# EAGLE design Lightpack6.0L (EAGLE 6.2)
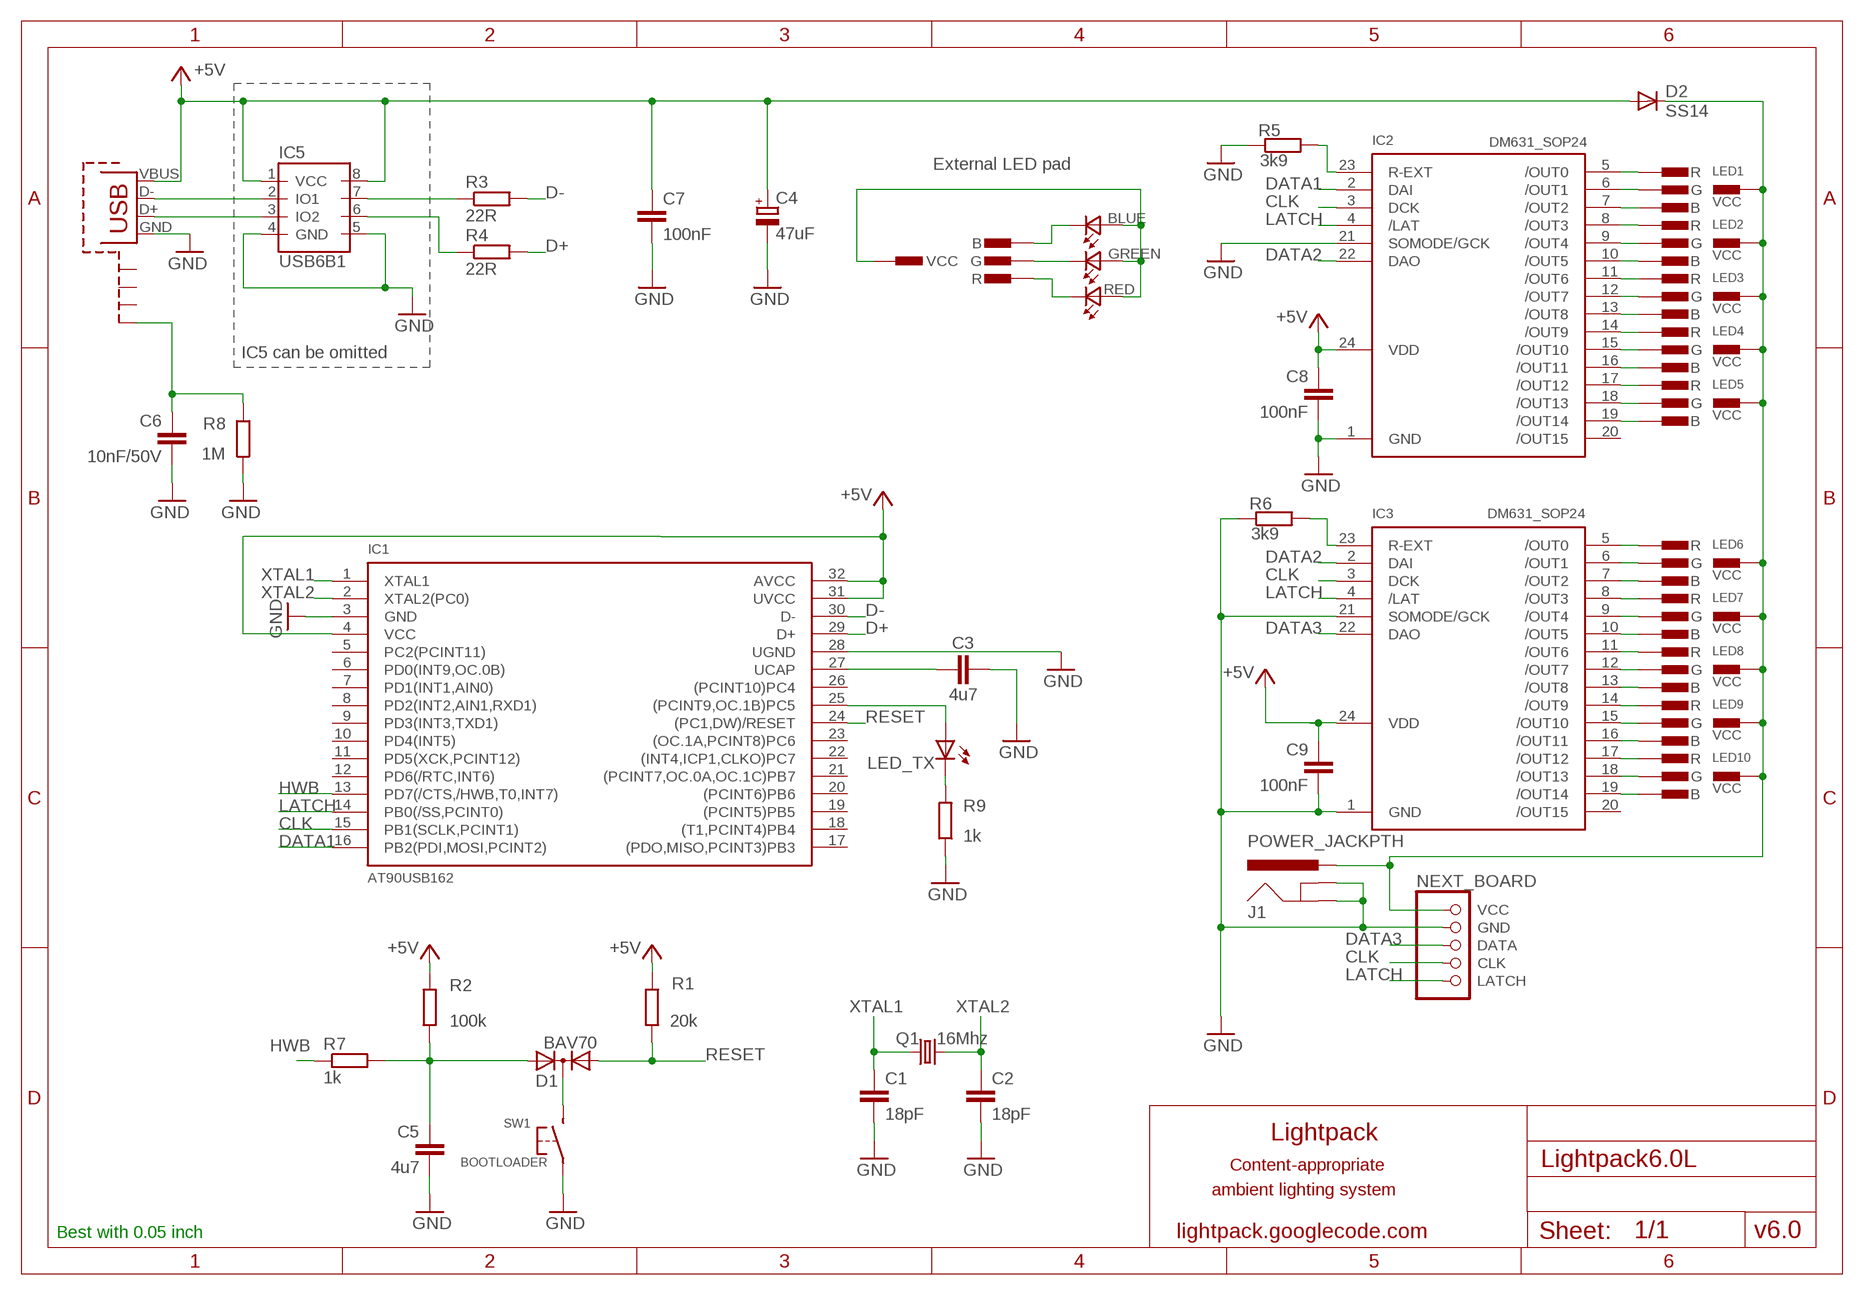
[diagram p0: schematic, sheet 1]

## Parts
C1  18pF  C-EUC1206  [C1206]
C2  18pF  C-EUC1206  [C1206]
C3  4u7  C-EUC1206  [C1206]
C4  47uF  CPOL-EUD/7343-31W  [D/7343-31W]
C5  4u7  C-EUC1206  [C1206]
C6  10nF/50V  C-EUC1206  [C1206]
C7  100nF  C-EUC1206  [C1206]
C8  100nF  C-EUC1206  [C1206]
C9  100nF  C-EUC1206  [C1206]
D1  BAV70  DIODE-2AC|CASOT23  [SOT23]
D2  SS14  DIODE-SMB  [SMB]
EXT_LED  TOPLED-3RF-W2SA50TS  [LP2C63-ST-RGB-SR0]
IC1  AT90USB162  [TQFP32]
IC2  DM631_SOP24  [SOP24-300-1.27]
IC3  DM631_SOP24  [SOP24-300-1.27]
IC5  USB6B1  [SO08]
J1  POWER_JACKPTH  [POWER_JACK_PTH]
LED1  CON-RGB-LED  [CON-RGB-LED]
LED2  CON-RGB-LED  [CON-RGB-LED]
LED3  CON-RGB-LED  [CON-RGB-LED]
LED4  CON-RGB-LEDVCC-INDENT  [CON-RGB-LED-WITH-VCC-INDENT]
LED5  CON-RGB-LEDVCC-INDENT  [CON-RGB-LED-WITH-VCC-INDENT]
LED6  CON-RGB-LED  [CON-RGB-LED]
LED7  CON-RGB-LED  [CON-RGB-LED]
LED8  CON-RGB-LED  [CON-RGB-LED]
LED9  CON-RGB-LED  [CON-RGB-LED]
LED10  CON-RGB-LED  [CON-RGB-LED]
LED12  CON-RGB-LED"  [CON-RGB-LED]
LED_TX  GREEN  LEDCHIPLED_0805  [CHIPLED_0805]
NEXT_BOARD  LED_DRIVER_BOARD  [DATA-CLK-LATCH]
Q1  16Mhz  CRYSTALHC49UP  [HC49UP]
R1  20k  R-EU_R1206  [R1206]
R2  100k  R-EU_R1206_2  [R1206]
R3  22R  R-EU_R1206  [R1206]
R4  22R  R-EU_R1206  [R1206]
R5  3k9  R-EU_R1206  [R1206]
R6  3k9  R-EU_R1206  [R1206]
R7  1k  R-EU_R1206  [R1206]
R8  1M  R-EU_R1206  [R1206]
R9  1k  R-EU_R1206  [R1206]
SW1  BOOTLOADER  BUTTON  [BUTTON-SMD]
X1  USB-MB-S  [USB-MB-S]

## Nets
+5V [VCC]: C4.+ C7.1 C8.1 C9.1 D2.A IC1.4(VCC) IC1.31(UVCC) IC1.32(AVCC) IC2.24(VDD) IC3.24(VDD) IC5.1(VCC) IC5.8(VCC) R1.2 R2.1 X1.VBUS
CLK: IC1.15(PB1(SCLK,PCINT1)) IC2.3(DCK) IC3.3(DCK) NEXT_BOARD.CLK
D+: IC1.29(D+) R4.2
D-: IC1.30(D-) R3.2
DATA1: IC1.16(PB2(PDI,MOSI,PCINT2)) IC2.2(DAI)
DATA2: IC2.22(DAO) IC3.2(DAI)
DATA3: IC3.22(DAO) NEXT_BOARD.DATA
GND: C1.2 C2.2 C3.1 C4.- C5.2 C6.2 C7.2 C8.2 C9.2 IC1.3(GND) IC1.28(UGND) IC2.1(GND) IC2.21(SOMODE/GCK) IC3.1(GND) IC3.21(SOMODE/GCK) IC5.4(GND) IC5.5(GND) J1.GND J1.GNDBREAK NEXT_BOARD.GND R5.1 R6.1 R8.1 R9.1 SW1.1 X1.GND
HWB: IC1.13(PD7(/CTS,/HWB,T0,INT7)) R7.1
LATCH: IC1.14(PB0(/SS,PCINT0)) IC2.4(/LAT) IC3.4(/LAT) NEXT_BOARD.LATCH
N$1: IC2.23(R-EXT) R5.2
N$2: IC3.8(/OUT3) LED7.R
N$3: IC2.13(/OUT8) LED3.B
N$4: EXT_LED.CGREEN LED12.G
N$5: IC2.5(/OUT0) LED1.R
N$6: IC2.6(/OUT1) LED1.G
N$7: IC2.7(/OUT2) LED1.B
N$8: IC1.25((PCINT9,OC.1B)PC5) LED_TX.A
N$9: IC2.8(/OUT3) LED2.R
N$10: IC2.9(/OUT4) LED2.G
N$11: IC2.10(/OUT5) LED2.B
N$12: IC2.11(/OUT6) LED3.R
N$13: IC2.12(/OUT7) LED3.G
N$14: EXT_LED.CBLUE LED12.B
N$15: IC2.14(/OUT9) LED4.R
N$16: EXT_LED.CRED LED12.R
N$17: EXT_LED.BLUE EXT_LED.GREEN EXT_LED.RED LED12.VCC
N$18: IC3.5(/OUT0) LED6.R
N$19: IC3.6(/OUT1) LED6.G
N$20: IC3.7(/OUT2) LED6.B
N$21: IC3.9(/OUT4) LED7.G
N$22: IC3.10(/OUT5) LED7.B
N$23: IC3.11(/OUT6) LED8.R
N$24: IC3.12(/OUT7) LED8.G
N$25: IC3.14(/OUT9) LED9.R
N$26: IC3.13(/OUT8) LED8.B
N$27: IC3.15(/OUT10) LED9.G
N$28: IC3.16(/OUT11) LED9.B
N$29: IC2.15(/OUT10) LED4.G
N$30: IC2.16(/OUT11) LED4.B
N$31: IC3.23(R-EXT) R6.2
N$32: IC5.2(IO1) X1.D-
N$33: IC5.6(IO2) R4.1
N$35: C6.1 R8.2 X1.SHIELD4
N$37: LED_TX.C R9.2
N$38: IC2.17(/OUT12) LED5.R
N$39: IC2.18(/OUT13) LED5.G
N$40: IC2.19(/OUT14) LED5.B
N$41: IC3.17(/OUT12) LED10.R
N$42: IC3.18(/OUT13) LED10.G
N$43: IC3.19(/OUT14) LED10.B
N$45: D1.3(C) SW1.2
N$47: C5.1 D1.2(A2) R2.2 R7.2
N$56: IC5.3(IO2) X1.D+
N$57 [VCC]: D2.C J1.PWR LED1.VCC LED2.VCC LED3.VCC LED4.VCC LED5.VCC LED6.VCC LED7.VCC LED8.VCC LED9.VCC LED10.VCC NEXT_BOARD.VCC
N$58: IC5.7(IO1) R3.1
N$60: C3.2 IC1.27(UCAP)
RESET: D1.1(A1) IC1.24((PC1,DW)/RESET) R1.1
XTAL1: C1.1 IC1.1(XTAL1) Q1.1
XTAL2: C2.1 IC1.2(XTAL2(PC0)) Q1.2
Unconnected: IC1.5(PC2(PCINT11)) IC1.6(PD0(INT9,OC.0B)) IC1.7(PD1(INT1,AIN0)) IC1.8(PD2(INT2,AIN1,RXD1)) IC1.9(PD3(INT3,TXD1)) IC1.10(PD4(INT5)) IC1.11(PD5(XCK,PCINT12)) IC1.12(PD6(/RTC,INT6)) IC1.17((PDO,MISO,PCINT3)PB3) IC1.18((T1,PCINT4)PB4) IC1.19((PCINT5)PB5) IC1.20((PCINT6)PB6) IC1.21((PCINT7,OC.0A,OC.1C)PB7) IC1.22((INT4,ICP1,CLKO)PC7) IC1.23((OC.1A,PCINT8)PC6) IC1.26((PCINT10)PC4) IC2.20(/OUT15) IC3.20(/OUT15) X1.SHIELD1 X1.SHIELD2 X1.SHIELD3

## Notes on the sheet
- External LED pad
- IC5 can be omitted
- Lightpack
- Content-appropriate
- ambient lighting system
- Best with 0.05 inch | lightpack.googlecode.com | v6.0

## Library data of the parts
C1-C3 C5-C9 = rcl:C-EU: CAPACITOR, European symbol
C4 = rcl:CPOL-EU: POLARIZED CAPACITOR, European symbol
D1 = diode:DIODE-2AC|CA: Dual DIODE Anode-Cathode|Cathode-Anode
D2 = diode:DIODE-: DIODE
EXT_LED = _led-rgb:TOPLED-3: OSRAM Edited: brunql Removed center pad in pcb - Hyper Multi TOPLED® (RGB) LB E673, LV E673, LT E673 - Power TOPLED® Enhanced optical Power LED (HOP2000) LS E67B, LA E67B, LO E67B, LY E67B - Hyper Multi TOPLED® Enhanced optical Power LED (HOP2000 / ATON®) LATB T66B - Hyper Multi TOPLED® Hyper-Bright LED LATB T686 Source: http://www.osram.convergy.de/
IC1 = AT90USB:AT90USB162: AT90USB162 Author: brunql.github.com
IC2 IC3 = _LedDrivers:DM631: DM631 Author: brunql.github.com
IC5 = st-microelectronics:USB6B1: DATA LINES PROTECTION Source: http://www.st.com/stonline/products/literature/ds/5605.pdf; MPN: USB6B1; OC_FARNELL: 9804358; OC_NEWARK: 26M4750
J1 = SparkFun:POWER_JACK: Power Jack This is the standard 5.5mm barrel jack for power. The PTH is the most common, proven, reliable, footprint. All others are experimental. The Slot footprint only works if the mill layer is transmitted to the PCB fab house so be warned. Spark Fun Electronics SKU : PRT-00119. Mating wall wart : TOL-00298 (and others)
LED1-LED3 LED6-LED10 = led-rgb:CON-RGB-LED
LED4 LED5 = br-led-rgb:CON-RGB-LED
LED12 = _led-rgb:CON-RGB-LED
LED_TX = led:LED: LED OSRAM: - CHIPLED LG R971, LG N971, LY N971, LG Q971, LY Q971, LO R971, LY R971 LH N974, LH R974 LS Q976, LO Q976, LY Q976 LO Q996 - Hyper CHIPLED LW Q18S LB Q993, LB Q99A, LB R99A - SideLED LS A670, LO A670, LY A670, LG A670, LP A670 LB A673, LV A673, LT A673, LW A673 LH A674 LY A675 LS A676, LA A676, LO A676, LY A676, LW A676 LS A679, LY A679, LG A679 - Hyper Micro SIDELED® LS Y876, LA Y876, LO Y876, LY Y876 LT Y87S - SmartLED LW L88C, LW L88S LB L89C, LB L89S, LG L890 LS L89K, LO L89K, LY L89K LS L896, LA L896, LO L896, LY L896 - TOPLED LS T670, LO T670, LY T670, LG T670, LP T670 LSG T670, LSP T670, LSY T670, LOP T670, LYG T670 LG T671, LOG T671, LSG T671 LB T673, LV T673, LT T673, LW T673 LH T674 LS T676, LA T676, LO T676, LY T676, LB T676, LH T676, LSB T676, LW T676 LB T67C, LV T67C, LT T67C, LS T67K, LO T67K, LY T67K, LW E67C LS E67B, LA E67B, LO E67B, LY E67B, LB E67C, LV E67C, LT E67C LW T67C LS T679, LY T679, LG T679 LS T770, LO T770, LY T770, LG T770, LP T770 LB T773, LV T773, LT T773, LW T773 LH T774 LS E675, LA E675, LY E675, LS T675 LS T776, LA T776, LO T776, LY T776, LB T776 LHGB T686 LT T68C, LB T68C - Hyper Mini TOPLED® LB M676 - Mini TOPLED Santana® LG M470 LS M47K, LO M47K, LY M47K Source: http://www.osram.convergy.de LUXEON: - LUMILED® LXK2-PW12-R00, LXK2-PW12-S00, LXK2-PW14-U00, LXK2-PW14-V00 LXK2-PM12-R00, LXK2-PM12-S00, LXK2-PM14-U00 LXK2-PE12-Q00, LXK2-PE12-R00, LXK2-PE12-S00, LXK2-PE14-T00, LXK2-PE14-U00 LXK2-PB12-K00, LXK2-PB12-L00, LXK2-PB12-M00, LXK2-PB14-N00, LXK2-PB14-P00, LXK2-PB14-Q00 LXK2-PR12-L00, LXK2-PR12-M00, LXK2-PR14-Q00, LXK2-PR14-R00 LXK2-PD12-Q00, LXK2-PD12-R00, LXK2-PD12-S00 LXK2-PH12-R00, LXK2-PH12-S00 LXK2-PL12-P00, LXK2-PL12-Q00, LXK2-PL12-R00 Source: www.luxeon.com KINGBRIGHT: KA-3528ASYC Source: www.kingbright.com
NEXT_BOARD = br-connectors:LED_DRIVER_BOARD: PIN HEADER
Q1 = crystal:CRYSTAL: CRYSTAL; OC_FARNELL: unknown; OC_NEWARK: unknown
R1 R2 R5 R6 = br-zero-res:R-EU_: RESISTOR, European symbol
R3 R4 R7-R9 = rcl:R-EU_: RESISTOR, European symbol
SW1 = button-smd:BUTTON: Button SMD
X1 = USB_miniB:USB: USB Connector miniUSB type B

## Net classes
1 VCC: width 0.6 mm, clearance 0.6 mm

## Board
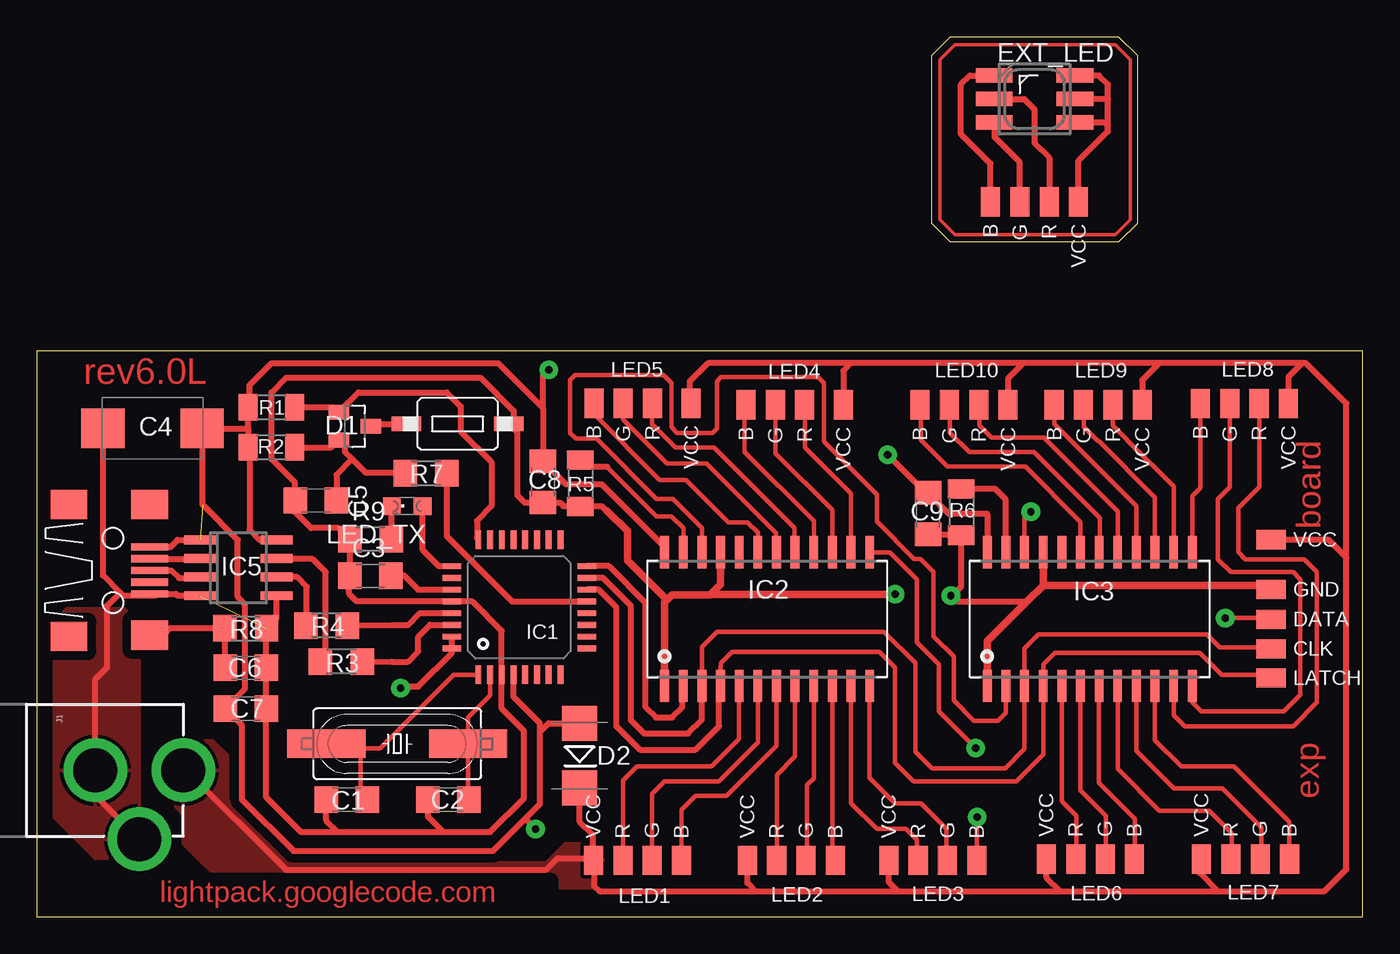
[diagram p1: board, top side]
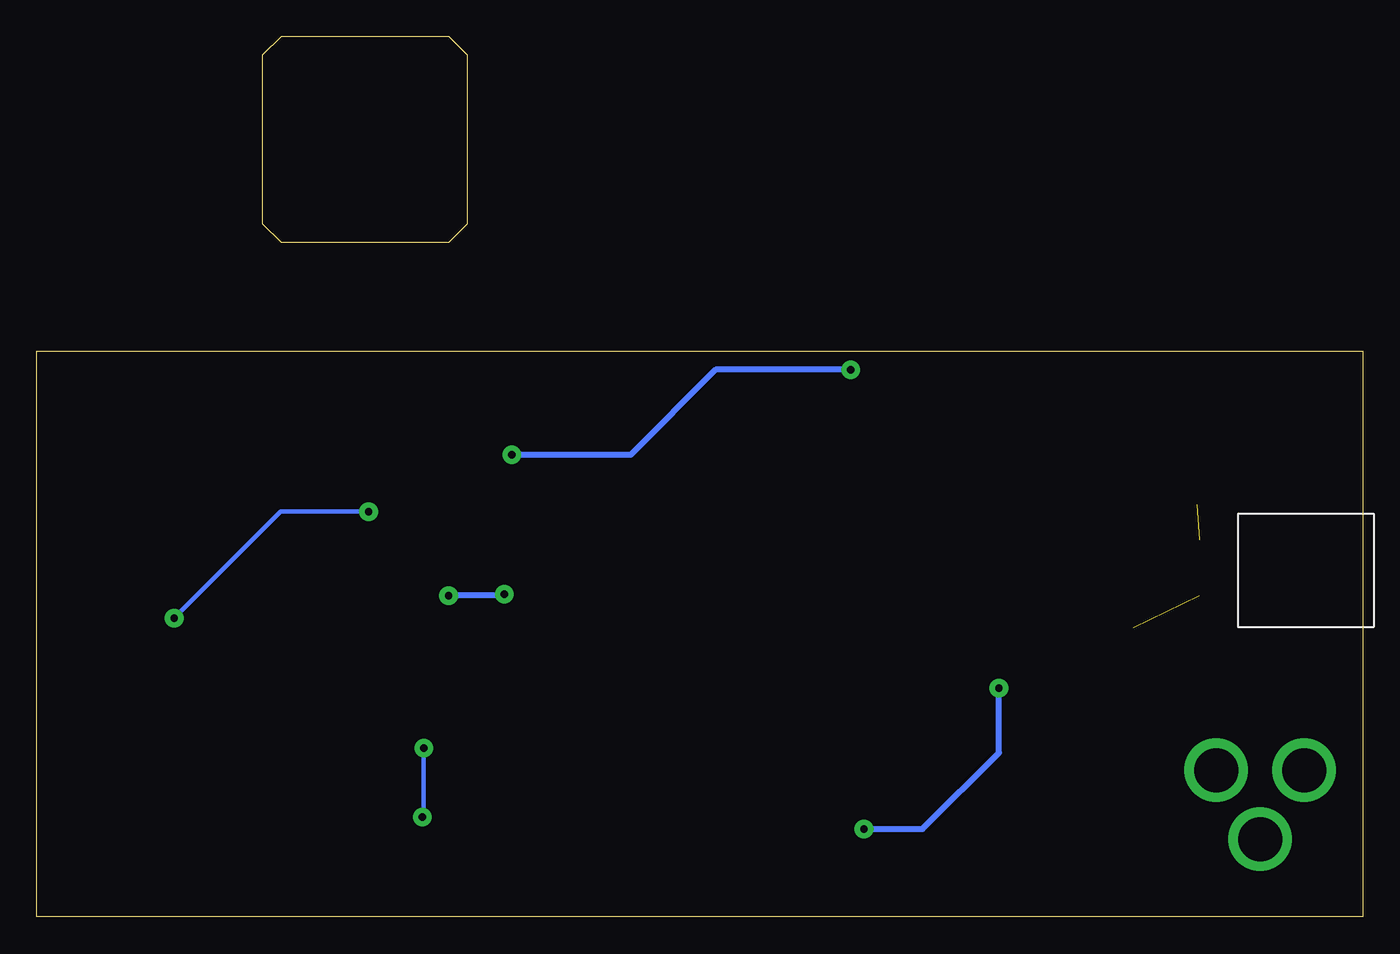
[diagram p2: board, bottom side, seen from below]

Size 90.38 x 60 mm. Coordinates in mm from the lower left corner, seen from the top.
Outline: 0,0 90.38,0 90.38,38.56 0,38.56 0,0
Outline: 61,58.73 62.27,60 73.73,60 75,58.73 75,47.27 73.73,46 62.27,46 61,47.27 61,58.73
Copper layers (1*16): Top 0.035mm / dielectric 1.5mm / Bottom 0.035mm
Design rules: minimum track width 10mil, minimum drill 24mil, track to track 8mil, track to pad 8mil, pad to pad 8mil, via to via 8mil, smd to smd 8mil, copper to edge 40mil, drill to drill 8mil, minimum pad ring 10mil, minimum via ring 8mil, stop-mask expansion 4mil, vias tented up to drill 0mil, thermal gap 10mil
tRestrict: 7 lines

### Footprints (pad centres in the part's own frame; a part is rotated, then mirrored left to right if it is on the bottom)
C1206 = smd 1.6 x 1.8: 1 -1.4,0; 2 1.4,0
D/7343-31W = smd 2.95 x 2.7: + 3.375,0; - -3.375,0
SOT23 = smd 1 x 1.4: 1 -0.95,-1.1; 2 0.95,-1.1; 3 0,1.1
SMB = smd 2.4 x 2.4: A 2.2,0; C -2.2,0
LP2C63-ST-RGB-SR0 = smd 2.5 x 1: BLUE 2.75,1.6; CBLUE -2.75,1.6; CGREEN -2.75,-1.6; CRED -2.75,0; GREEN 2.75,-1.6; RED 2.75,0
TQFP32 = smd 1.27 x 0.4: 1 -4.61,2.82; 2 -4.61,2.02; 3 -4.61,1.22; 4 -4.61,0.42; 5 -4.61,-0.38; 6 -4.61,-1.18; 7 -4.61,-1.98; 8 -4.61,-2.78; 17 4.59,-2.78; 18 4.59,-1.98; 19 4.59,-1.18; 20 4.59,-0.38; 21 4.59,0.42; 22 4.59,1.22; 23 4.59,2.02; 24 4.59,2.82 | smd 0.4 x 1.27: 9 -2.81,-4.58; 10 -2.01,-4.58; 11 -1.21,-4.58; 12 -0.41,-4.58; 13 0.39,-4.58; 14 1.19,-4.58; 15 1.99,-4.58; 16 2.79,-4.58; 25 2.79,4.62; 26 1.99,4.62; 27 1.19,4.62; 28 0.39,4.62; 29 -0.41,4.62; 30 -1.21,4.62; 31 -2.01,4.62; 32 -2.81,4.62
SOP24-300-1.27 = smd 0.6 x 2.2: 1 -6.85,-4.635; 2 -5.58,-4.635; 3 -4.31,-4.635; 4 -3.04,-4.635; 5 -1.77,-4.635; 6 -0.5,-4.635; 7 0.77,-4.635; 8 2.04,-4.635; 9 3.31,-4.635; 10 4.58,-4.635; 11 5.85,-4.635; 12 7.12,-4.635; 13 7.12,4.47; 14 5.85,4.47; 15 4.58,4.47; 16 3.31,4.47; 17 2.04,4.47; 18 0.77,4.47; 19 -0.5,4.47; 20 -1.77,4.47; 21 -3.04,4.47; 22 -4.31,4.47; 23 -5.58,4.47; 24 -6.85,4.47
SO08 = smd 0.6 x 2.2: 1 -1.905,-2.6; 2 -0.635,-2.6; 3 0.635,-2.6; 4 1.905,-2.6; 5 1.905,2.6; 6 0.635,2.6; 7 -0.635,2.6; 8 -1.905,2.6
POWER_JACK_PTH = drill 2.997 pad 4.318: GND 0,7.7; GNDBREAK 4.7,10.7; PWR 0,13.7
CON-RGB-LED = smd 2 x 1.3: B 0,-3; G 0,-1; R 0,1; VCC 0,3
CON-RGB-LED-WITH-VCC-INDENT = smd 2 x 1.3: B 0,-3; G 0,-1; R 0,1; VCC 0,3.635
CHIPLED_0805 = smd 1.2 x 1.2: A 0,-1.05; C 0,1.05
DATA-CLK-LATCH = smd 2 x 1.3: CLK 0,-1.905; DATA 0,0.095; GND 0,2.127; LATCH 0,-3.905; VCC 0,5.524
HC49UP = smd 5.334 x 1.93: 1 -4.826,0; 2 4.826,0
R1206 = smd 1.3 x 1.803: 1 -1.581,0; 2 1.581,0
R1206' = smd 1.6 x 1.803: 1 -1.422,0; 2 1.422,0
BUTTON-SMD = smd 2 x 1: 1 -3.5,0; 2 3.5,0
USB-MB-S = smd 2.5 x 0.5: D+ 2.5,0; D- 2.5,0.8; GND 2.5,-1.6; ID 2.5,-0.8; VBUS 2.5,1.6 | smd 2.5 x 2: SHIELD1 2.5,4.5; SHIELD2 -3,4.5; SHIELD3 -3,-4.5; SHIELD4 2.5,-4.4

### Placement (x,y rotation side)
C1  21.14,8 180 top
C2  28.06,8 180 top
C3  22.75,23.25 0 top
C4  7.9,33.3 0 top
C5  19.03,28.39 180 top
C6  14.25,16.98 0 top
C7  14.25,14.2 0 top
C8  34.5,29.65 270 top
C9  60.75,27.5 270 top
D1  21.68,33.45 270 top
D2  37,11 90 top
EXT_LED  68,55.75 0 top
IC1  32.91,21.12 90 top
IC2  49.65,20.39 0 top
IC3  71.63,20.39 0 top
IC5  13.75,23.8 270 top
J1  -3.7,10 270 top
LED1  40.95,3.86 90 top
LED2  51.44,3.86 90 top
LED3  61.08,3.86 90 top
LED4  51.34,34.9 270 top
LED5  40.97,35.02 270 top
LED6  71.81,3.96 90 top
LED7  82.38,3.96 90 top
LED8  82.31,35 270 top
LED9  72.34,34.9 270 top
LED10  63.2,34.9 270 top
LED12  68,48.75 270 top
LED_TX  25.25,28 90 top
NEXT_BOARD  84.12,20.19 0 top
Q1  24.57,11.81 0 top
R1  16,34.75 180 top
R2  16,32 0 top
R3  22R  [R1206']  20.76,17.41 0 top
R4  22R  [R1206']  19.76,19.87 0 top
R5  37.05,29.55 90 top
R6  63.01,27.6 90 top
R7  1k  [R1206']  26.54,30.25 180 top
R8  1M  [R1206']  14.25,19.68 180 top
R9  1k  [R1206']  22.75,25.75 0 top
SW1  28.69,33.61 180 top
X1  5.21,23.62 0 top

### Tracks (layer width: path | path; a pad name or v marks a point on that pad's centre or on a via)
+5V  (via drill 0.5 pad 1.27)  (1 unrouted)
  Top 0.406: IC3.24 64.78,27.47 64.75,27.5 62.15,27.5 C9.1 60.6,28.9 v58,31.5 | IC2.24 42.8,25.2 38.5,29.5 36.05,29.5 C8.1 34.5,34.7 | v34.9,37.3 34.5,36.9 34.5,34.7 | 34.5,34.7 31.45,37.75 16,37.75 14.5,36.25 14.5,34.83 R1.2 14.42,33.3 | IC5.8 15.2,25.7 14.5,26.4 14.5,31.92 R2.1 | R2.1 14.42,32.83 | 14.42,33.3 R2.1 | IC1.31 IC1.32 28.3,18 26,15.7 24.9,15.7 v24.8,15.6 | 14.42,33.3 C4.+ 11.3,33.33 11.3,28.1 13.7,25.7 13.7,21.8 14.2,21.3 14.2,15.55 C7.1 | IC1.4 32.49,15.01 34.3,13.2 34.3,12.6 | D2.A 34.9,13.2 34.3,12.6 | C7.1 12.5,13.85 | v34,6 33.31,6.69 33.29,6.69 | 34.3,12.6 34.3,7.7 33.29,6.69 | C7.1 14,13.05 14,8 17.5,4.5 31.1,4.5 33.29,6.69 | X1.VBUS 9.12,25.22 9.6,25.7 IC5.1
  Bottom 0.406: v58,31.5 49.9,31.5 44.1,37.3 v34.9,37.3 | v24.8,15.6 24.8,11.2 30,6 v34,6
CLK
  Top 0.305: IC2.3 45.34,18.4 46.38,19.44 57.75,19.44 59.88,17.31 59.88,11.25 61,10.12 66,10.12 67.32,11.45 IC3.3 67.32,18.32 68.25,19.25 79.75,19.25 80.62,18.38 84.03,18.38 NEXT_BOARD.CLK
  Top 0.406: IC2.3 45.34,13.44 44.4,12.5 41.4,12.5 40.5,13.4 40.5,21.2 38.59,23.11 IC1.15
D+
  Top 0.406: IC1.29 26.11,20.71 25.3,19.9 24.21,19.9 R4.2
D-
  Top 0.406: IC1.30 26.81,19.91 26,19.1 26,18.1 25.3,17.4 24.19,17.4 R3.2
DATA1
  Top 0.406: IC2.2 44,15.69 44,14.3 43.3,13.6 42.2,13.6 41.5,14.3 41.5,21.4 38.99,23.91 IC1.16
DATA2
  Top 0.305: IC3.2 66.05,13.93 65.5,13.38 63.88,13.38 62.5,14.75 62.5,17.75 61.12,19.12 61.12,23.5 60.22,24.4 59.8,24.4 57.25,26.95 57.25,28.8 53.65,32.4 53.65,36.4 53.24,36.81 49,36.81 48.99,36.8 46.65,36.8 46.35,36.5 46.35,33.3 46.05,33 43.65,33 43.25,33.4 43.25,36.4 42.71,36.94 36.69,36.94 36.35,36.6 36.35,33 36.75,32.6 38.15,32.6 42.25,28.5 43.35,28.5 45.35,26.5 45.35,24.87 IC2.22
DATA3  (via drill 0.5 pad 1.27)
  Top 0.305: IC3.22 67.32,27.2 v67.75,27.62 | v81,20.38 84.03,20.38 NEXT_BOARD.DATA
  Bottom 0.305: v67.75,27.62 73.75,27.62 v81,20.38
GND  (via drill 0.5 pad 1.27)  (1 unrouted)
  Top 0.305: 42.8,21.77 42.8,21.44 | 45.88,21.94 45.91,21.97 | 83.83,22.61 NEXT_BOARD.GND
  Top 0.406: 38.88,27.67 38.83,27.67 38.5,28 37.08,28 R5.1 37.03,28 35.9,28 35.65,28.25 C8.2 33.25,28.25 32.75,28.75 32.75,33.04 SW1.1 32.5,33.29 | R8.1 15.65,19.65 C6.2 C7.2 15.65,8.15 18,5.8 20.5,5.8 | 32.5,33.29 32.5,34.5 30.25,36.75 17,36.75 16,35.75 16,31.2 17.6,29.6 17.6,28.41 C5.2 17.6,28.36 17.6,27.6 18.7,26.5 20.58,26.5 R9.1 21.35,25.73 C3.1 21.3,23.2 21.3,22 21.79,21.51 IC1.28 29.7,21.5 31.7,19.5 IC1.3 31.7,14.21 33.2,12.7 33.2,8.1 30.9,5.8 27.7,5.8 | 32.5,33.29 32.5,33.25 | C9.2 60.83,26.02 R6.1 63.01,22.51 62.4,21.9 | 67.48,21.5 62.8,21.5 62.4,21.9 | v58.5,22 58.03,22 58,21.97 | v62.3,21.9 62.4,21.9 | 20.5,5.8 27.7,5.8 | C2.2 26.66,6.84 27.7,5.8 | C1.2 19.73,6.57 20.5,5.8 | 6.78,22.02 X1.GND 8.2,22.02 | R8.1 15.75,19.6 | R8.1 15.65,19.7 | 8.2,22.02 9.48,22.02 9.6,21.9 IC5.4 | C4.- 4.53,23.27 5.7,22.1 | IC5.5 16.35,20.35 R8.1 | 5.7,22.1 4.8,21.2 4.8,17 4,16.2 J1.GND 4,8.3 J1.GNDBREAK | 5.7,22.1 5.9,21.9 8.08,21.9 8.2,22.02
  Top 0.5: IC2.1 42.8,21.44 43.3,21.94 45.88,21.94 | IC2.21 46.6,22.67 45.91,21.97 58,21.97 58.45,21.97 | 42.8,21.77 40.25,24.31 40.25,26.3 38.88,27.67 | IC3.1 64.78,18.8 67.48,21.5 68.59,22.61 | 68.59,22.61 IC3.21 | 68.59,22.61 83.83,22.61
  Bottom 0.406: v62.3,21.9 58.6,21.9 v58.5,22
  pour Top (isolate 0.61): 1,7 1,20 2,21 6,21 7,20 7,4 4,4
HWB
  Top 0.406: R7.1 27.96,25.94 32.4,21.5 IC1.13
LATCH
  Top 0.305: IC2.4 46.6,17.11 46.62,17.12 46.62,17.31 47.38,18.06 57.44,18.06 58.5,17 58.5,10.5 59.75,9.25 66.75,9.25 68.59,11.09 IC3.4 68.59,17.21 69.38,18 79.25,18 80.75,16.5 83.91,16.5 NEXT_BOARD.LATCH
  Top 0.406: IC2.4 46.5,15.65 46.5,13 44.9,11.4 41.1,11.4 39.5,13 39.5,21.1 38.29,22.31 IC1.14
N$1
  Top 0.305: IC2.23 44.06,26.51 43.27,27.3 42.25,27.3 38.87,30.68 | R5.2 37.06,30.68
  Top 0.406: 38.87,30.68 37.31,30.68 R5.2
N$2
  Top 0.305: IC3.8 73.67,10.08 76.5,7.25 79.9,7.25 81.45,5.7 81.45,4.03 LED7.R 81,3.88
N$3  (via drill 0.5 pad 1.27)
  Top 0.305: IC2.13 58.14,24.86 60,23 60,18.7 61.5,17.2 61.5,14 v64,11.5 | LED3.B 64.08,6.78 v64.1,6.8
  Bottom 0.305: v64,11.5 64,6.8 64.1,6.7 v64.1,6.8
N$4
  Top 0.406: LED12.G 67,51.45 65.3,53.15 65.3,54.1 EXT_LED.CGREEN
N$5
  Top 0.305: IC2.5 47.88,12.12 46,10.25 40.9,10.25 39.95,9.3 LED1.R
N$6
  Top 0.305: IC2.6 49.15,11.89 46.5,9.25 42.8,9.25 41.95,8.4 LED1.G
N$7
  Top 0.305: IC2.7 50.41,11.66 47,8.25 44.9,8.25 43.95,7.3 LED1.B
N$8
  Top 0.406: IC1.25 27.39,23.91 26.3,25 LED_TX.A
N$9
  Top 0.305: LED2.R 50.44,9.69 51.69,10.94 IC2.8
N$10
  Top 0.305: IC2.9 52.95,9.46 52.5,9 52.5,3.92 LED2.G
N$11
  Top 0.305: IC2.10 54.23,4.07 LED2.B
N$12
  Top 0.305: IC2.11 55.49,7.75 57.25,6 59.25,6 60,5.25 60,3.93 LED3.R
N$13
  Top 0.305: IC2.12 56.77,9.48 58.5,7.75 60.25,7.75 62,6 62,3.93 LED3.G
N$14
  Top 0.406: EXT_LED.CBLUE 63.6,57.35 63,56.75 63,53.35 65,51.35 LED12.B
N$15
  Top 0.305: IC2.14 55.49,28.86 52.35,32 52.35,34.88 LED4.R
N$16
  Top 0.406: LED12.R 69,51.75 68,52.75 68,55.05 67.3,55.75 EXT_LED.CRED
N$17
  Top 0.406: EXT_LED.BLUE 72.4,57.35 73,56.75 73,55.75 | 73,53.95 73,53.55 71,51.55 LED12.VCC | 73,53.95 73,55.75 | EXT_LED.GREEN 72.8,54.15 73,53.95 | 73,55.75 EXT_LED.RED
N$18
  Top 0.305: IC3.5 69.86,7.89 70.85,6.9 70.85,3.99 LED6.R
N$19
  Top 0.305: IC3.6 71.13,8.62 72.85,6.9 72.85,3.99 LED6.G
N$20
  Top 0.305: IC3.7 72.4,9.15 74.85,6.7 74.85,3.99 LED6.B
N$21
  Top 0.305: IC3.9 74.94,11.31 77.5,8.75 80.8,8.75 83.45,6.1 83.45,4.03 LED7.G 83,3.88
N$22
  Top 0.305: IC3.10 76.21,12.04 78,10.25 81.6,10.25 85.35,6.5 85.35,3.99 LED7.B 85,3.88
N$23
  Top 0.305: IC3.11 77.5,15.73 77.5,13.75 78.25,13 85.62,13 87.25,14.62 87.25,23.5 86.38,24.38 82.38,24.38 81.88,24.88 81.88,27.88 83.31,29.3 LED8.R
N$24
  Top 0.305: IC3.12 78.75,14.62 79.38,14 85,14 86.12,15.12 86.12,23 85.62,23.5 81.38,23.5 80.5,24.38 80.5,28.5 81.31,29.3 LED8.G
N$25
  Top 0.305: IC3.14 77.48,29.33 74.34,32.47 74.34,32.51 73.35,33.5 73.35,34.89 LED9.R
N$26
  Top 0.305: IC3.13 78.75,28.69 79.31,29.24 LED8.B
N$27
  Top 0.305: IC3.15 76.21,28.6 72.38,32.44 72.31,32.44 71.35,33.4 71.35,34.89 LED9.G
N$28
  Top 0.305: LED9.B 69.35,34.89 69.35,33.6 74.95,28 IC3.16
N$29
  Top 0.305: IC2.15 54.23,27.73 50.35,31.6 50.35,34.88 LED4.G
N$30
  Top 0.305: IC2.16 52.95,27 48.25,31.7 48.25,34.81 LED4.B
N$31
  Top 0.406: R6.2 65.32,29.18 66.05,28.45 IC3.23
N$32
  Top 0.406: X1.D- 11.13,24.42 IC5.2
N$33
  Top 0.406: R4.1 18.4,19.93 18.4,22.5 17.73,23.16 IC5.6
N$34
  Top 0.254: 61.56,58.44 62.58,59.45 73.5,59.45 74.52,58.44 74.52,47.51 73.5,46.5 62.58,46.5 61.56,47.51 61.56,58.44
N$35
  Top 0.406: 12.83,17.01 C6.1 12.8,17.03 12.8,19.7 | X1.SHIELD4 8.62,19.22 9.1,19.7 12.8,19.7 | 12.8,19.7 R8.2
N$37
  Top 0.406: LED_TX.C 24.2,25.78 R9.2
N$38
  Top 0.305: 51.62,24.92 IC2.17 51.65,24.89 51.65,26.5 46.15,32 43.55,32 41.95,33.6 41.95,35 LED5.R
N$39
  Top 0.305: IC2.18 50.38,24.9 50.38,26.19 45.66,30.9 42.95,30.9 39.95,33.9 39.95,35 LED5.G
N$40
  Top 0.305: IC2.19 49.12,24.88 | LED5.B 37.95,35 37.95,34.3 42.45,29.8 44.25,29.8 47.15,26.9 48.45,26.9 49.15,26.2 IC2.19 | IC2.19 49.05,24.95
N$41
  Top 0.305: IC3.17 73.67,27.64 68.62,32.69 65.06,32.69 64.25,33.5 64.25,34.85 LED10.R
N$42
  Top 0.305: IC3.18 72.45,24.91 72.45,27.2 67.96,31.69 63.56,31.69 62.25,33 62.25,34.85 LED10.G
N$43
  Top 0.305: IC3.19 71.13,26.93 67.38,30.69 62.06,30.69 60.25,32.5 60.25,34.85 LED10.B
N$45
  Top 0.406: SW1.2 22.93,33.61 D1.3
N$47
  Top 0.406: 17.43,31.85 R2.2 20.08,32 D1.2 21,32.5 21,31.7 21.5,31.2 | 21.5,31.2 22.4,30.3 25.07,30.3 R7.2 | C5.1 20.43,30.13 21.5,31.2
N$56
  Top 0.406: 6.98,23.62 X1.D+ 9.18,23.62 9.7,23.1 11.09,23.1 IC5.3
N$57
  Top 0.406: 49,1.75 58.7,1.75 | 58.7,1.75 69.75,1.75 | 69.75,1.75 80.5,1.75 | 89.25,24.5 89.25,3.25 87.75,1.75 80.5,1.75 | 89.25,24.5 89.25,35 86.5,37.75 86.25,37.75 | 86.25,37.75 76.5,37.75 | 76.5,37.75 67.25,37.75 | 67.25,37.75 55.5,37.75 | 55.5,37.75 45.75,37.75 44.5,36.5 44.5,35.13 LED5.VCC | LED4.VCC 54.97,37.22 55.5,37.75 | LED10.VCC 66.2,36.7 67.25,37.75 | LED9.VCC 75.34,36.59 76.5,37.75 | LED8.VCC 85.31,36.8 86.25,37.75 | NEXT_BOARD.VCC 88.04,25.71 89.25,24.5 | 80.5,1.75 79.25,3 79.25,3.83 LED7.VCC | LED6.VCC 68.81,2.69 69.75,1.75 | LED2.VCC 48.44,2.31 49,1.75 | 49,1.75 38.35,1.75 38,2.1 38,3.8 LED1.VCC | LED3.VCC 58.08,2.38 58.7,1.75 | LED1.VCC 37.9,3.9 37.9,5.6 37,6.5 D2.C | J1.PWR 10.2,10 17,3.2 34.7,3.2 35.5,4 37.8,4 LED1.VCC
  pour Top: 8,10 8,11 9,12 12,12 13,11 13,8 17,4 17.3,3.7 34.7,3.7 36,5 38,5 39,4 39,3 38,2 13,2 10,5 10,7 8,9
N$58
  Top 0.406: R3.1 19.7,17.77 19.7,23.5 18.8,24.4 16.39,24.4 IC5.7
N$60
  Top 0.406: IC1.27 25.99,22.31 25,23.3 24.2,23.3 C3.2
RESET
  Top 0.406: R1.1 20.23,34.75 D1.1 21.93,35.75 27.95,35.75 28.9,34.8 28.9,33.1 31,31 31,28 30,27 30,25.8 IC1.24
XTAL1
  Top 0.305: 21.07,11.54 20.02,11.54 Q1.1 20.8,11.81 21.07,11.54 | 21.07,11.54 22.07,11.54 22.07,8.46 C1.1 | IC1.1 28.41,16.51 23.4,11.5 21.11,11.5 21.07,11.54
XTAL2
  Top 0.305: 30.58,11.79 30.55,11.81 Q1.2 | Q1.2 29.33,11.88 | IC1.2 30.9,15.1 29.4,13.6 Q1.2 | Q1.2 29.4,8.06 C2.1

### Text on the board
Top: rev6.0L | board | exp | lightpack.googlecode.com